# Altium schematic sheet PMU.SchDoc: main_assy PCB
size A4
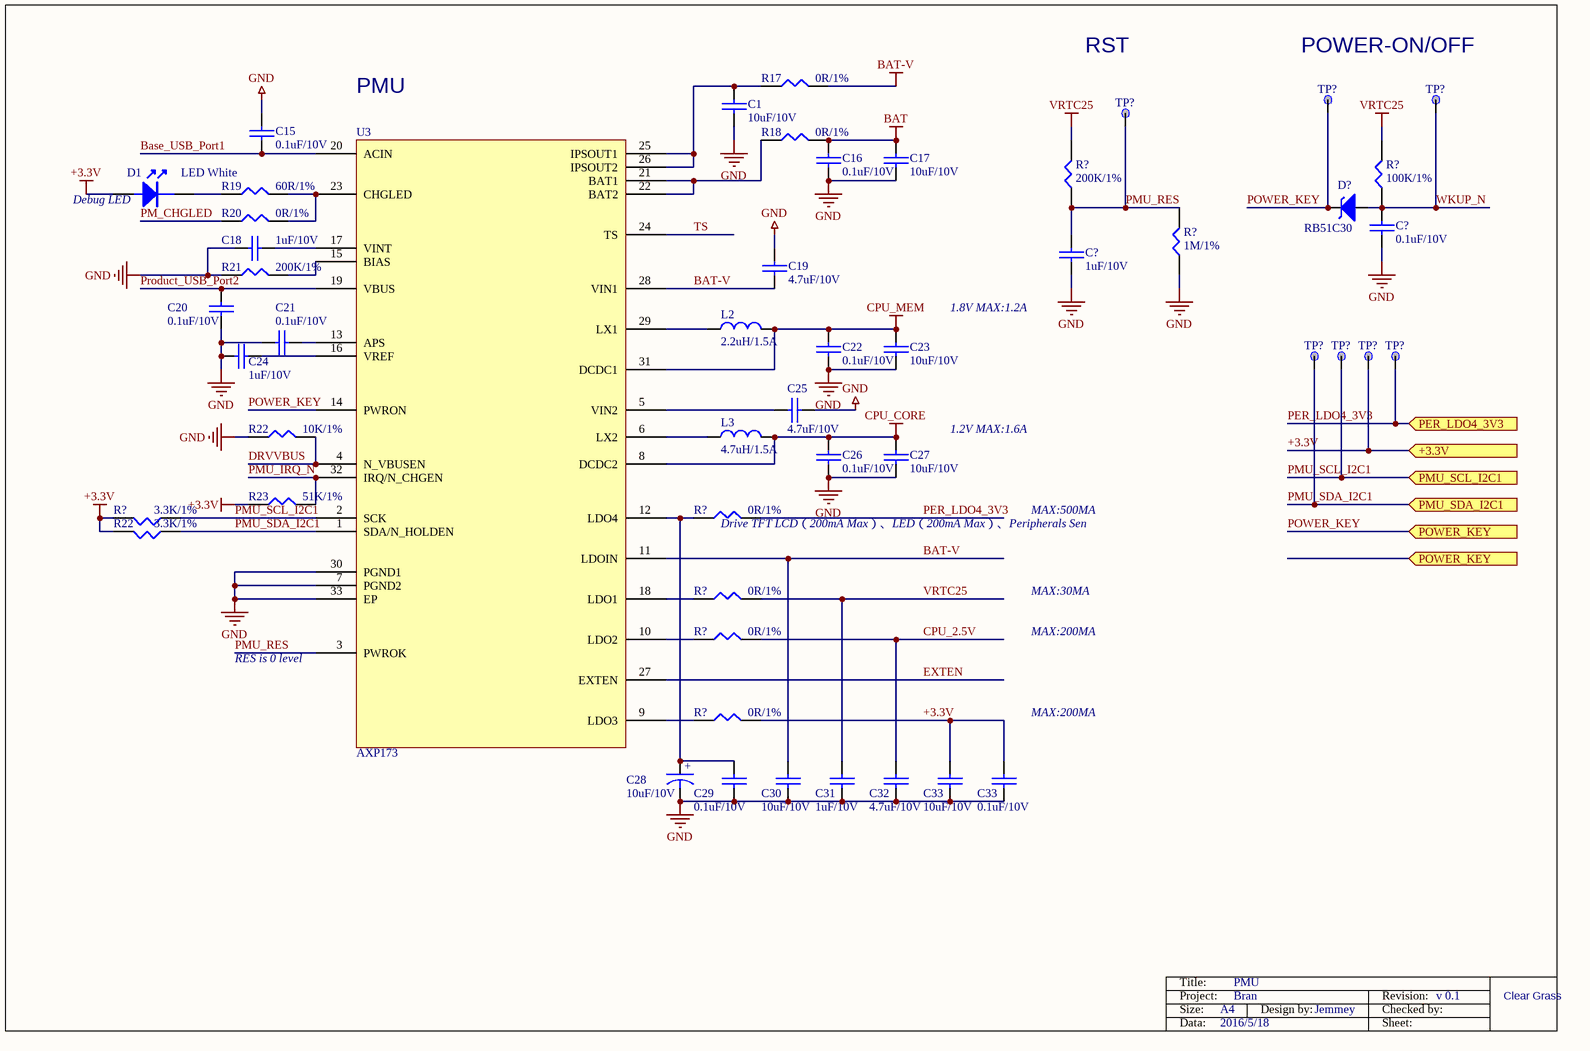
[diagram p0: PMU.SchDoc]

## Parts
(Parts that share a designator on the sheet are numbered #1, #2 ... from top to bottom, then left to right.)
C1  10uF/10V  [0402C]
C15  0.1uF/10V  [0402C]
C16  0.1uF/10V  [0402C]
C17  10uF/10V  [0402C]
C18  1uF/10V  [0402C]
C19  4.7uF/10V  [0402C]
C20  0.1uF/10V  [0402C]
C21  0.1uF/10V  [0402C]
C22  0.1uF/10V  [0402C]
C23  10uF/10V  [0402C]
C24  1uF/10V  [0402C]
C25  4.7uF/10V  [0402C]
C26  0.1uF/10V  [0402C]
C27  10uF/10V  [0402C]
C28  10uF/10V  [6032]
C29  0.1uF/10V  [0402C]
C30  10uF/10V  [0402C]
C31  1uF/10V  [0402C]
C32  4.7uF/10V  [0402C]
C33#1  10uF/10V  [0402C]
C33#2  0.1uF/10V  [0402C]
C?#1  0.1uF/10V  [0402C]
C?#2  1uF/10V  [0402C]
D1  LED White  [0402LED]
D?  RB51C30  [DO-214AC]
L2  2.2uH/1.5A  [Inductance]
L3  4.7uH/1.5A  [Inductance]
R17  0R/1%  [0402R]
R18  0R/1%  [0402R]
R19  60R/1%  [0402R]
R20  0R/1%  [0402R]
R21  200K/1%  [0402R]
R22#1  10K/1%  [0402R]
R22#2  3.3K/1%  [0402R]
R23  51K/1%  [0402R]
R?#1  200K/1%  [0402R]
R?#2  100K/1%  [0402R]
R?#3  1M/1%  [0402R]
R?#4  0R/1%  [0402R]
R?#5  3.3K/1%  [0402R]
R?#6  0R/1%  [0402R]
R?#7  0R/1%  [0402R]
R?#8  0R/1%  [0402R]
TP?#1  TP  [TP_C40]  (value not drawn)
TP?#2  TP  [TP_C40]  (value not drawn)
TP?#3  TP  [TP_C40]  (value not drawn)
TP?#4  TP  [TP_C40]  (value not drawn)
TP?#5  TP  [TP_C40]  (value not drawn)
TP?#6  TP  [TP_C40]  (value not drawn)
TP?#7  TP  [TP_C40]  (value not drawn)
U3  AXP173

## Ports
+3.3V (in), PER_LDO4_3V3 (in), PMU_SCL_I2C1 (in), PMU_SDA_I2C1 (in), POWER_KEY (in)

## Nets
+3.3V: C33#1.1 C33#2.1 D1.2 R22#2.2 R23.1 R?#5.2 R?#8.2 TP?#6.1 ; port +3.3V
BAT: C16.2 C17.2 R18.2
BAT-V: C19.2 C30.1 R17.2 U3.11(LDOIN) U3.28(VIN1)
CPU_CORE: C26.2 C27.2 L3.2 U3.8(DCDC2)
CPU_MEM: C22.2 C23.2 L2.2 U3.31(DCDC1)
GND: C1.1 C15.2 C16.1 C17.1 C18.2 C19.1 C20.1 C21.2 C22.1 C23.1 C24.2 C25.1 C26.1 C27.1 C28.2 C29.1 C30.2 C31.2 C32.2 C33#1.2 C33#2.2 C?#1.1 C?#2.1 R21.1 R22#1.1 R?#3.1 U3.7(PGND2) U3.30(PGND1) U3.33(EP)
VRTC25: C31.1 R?#1.2 R?#2.2 R?#6.2
Base_USB_Port1: C15.1 U3.20(ACIN)
CPU_2.5V: C32.1 R?#7.2
DRVVBUS: R22#1.2 U3.4(N_VBUSEN)
EXTEN: U3.27(EXTEN)
PER_LDO4_3V3: R?#4.2 TP?#7.1 ; port PER_LDO4_3V3
PM_CHGLED: R20.1
PMU_IRQ_N: R23.2 U3.32(IRQ/N_CHGEN)
PMU_RES: C?#2.2 R?#1.1 R?#3.2 TP?#3.1 U3.3(PWROK)
PMU_SCL_I2C1: R?#5.1 TP?#5.1 U3.2(SCK) ; port PMU_SCL_I2C1
PMU_SDA_I2C1: R22#2.1 TP?#4.1 U3.1(SDA/N_HOLDEN) ; port PMU_SDA_I2C1
POWER_KEY: D?.1(K) TP?#1.1 U3.14(PWRON) ; port POWER_KEY
Product_USB_Port2: C20.2 U3.19(VBUS)
TS: U3.24(TS)
WKUP_N: C?#1.2 D?.2(A) R?#2.1 TP?#2.1
NetC1_2: C1.2 R17.1 U3.25(IPSOUT1) U3.26(IPSOUT2)
NetC18_1: C18.1 U3.17(VINT)
NetC21_1: C21.1 U3.13(APS)
NetC24_1: C24.1 U3.16(VREF)
NetC25_2: C25.2 U3.5(VIN2)
NetC28_1: C28.1 C29.2 R?#4.1 U3.12(LDO4)
NetD1_1: D1.1 R19.1
NetL2_1: L2.1 U3.29(LX1)
NetL3_1: L3.1 U3.6(LX2)
NetR18_1: R18.1 U3.21(BAT1) U3.22(BAT2)
NetR19_2: R19.2 R20.2 U3.23(CHGLED)
NetR21_2: R21.2 U3.15(BIAS)
NetR?#6_1: R?#6.1 U3.18(LDO1)
NetR?#7_1: R?#7.1 U3.10(LDO2)
NetR?#8_1: R?#8.1 U3.9(LDO3)

## Notes on the sheet
- PMU
- RST
- (near TP?#1) POWER-ON/OFF
- (near D1) Debug LED
- 1.8V MAX:1.2A
- 1.2V MAX:1.6A
- MAX:500MA
- (near R?#4) Drive TFT LCD（200mA Max）、LED（200mA Max）、Peripherals Sen
- MAX:30MA
- MAX:200MA
- (near U3) RES is 0 level
- Title:
- Project:
- Size:
- Data:
- A4
- 2016/5/18
- Bran
- Design by:
- Jemmey
- Revision:
- Sheet:
- Checked by:
- v 0.1
- Clear Grass
- (in symbol Capacitor) +

## Library data of the parts
C1 C15-C27 C29-C32 C33#1 C33#2 C?#1 C?#2 = CAP: 厂家：Murata，型号：GRM155R71A104KA01D
C28 = Capacitor
D1 = LED: 厂家：ROHM，型号：SCMP13WBC8W1**
D? = Schottky barri: 厂家：ROHM，型号：RB480Y-90
L2 L3 = CHOKE
R17-R21 R22#1 R22#2 R23 R?#1-R?#8 = RES1: 厂家：Yageo，型号：RC0402FR-0710KL
TP?#1-TP?#7 = TP: Ordered by: Subcon